# EAGLE design USB-BOARD (EAGLE 8.6.1)
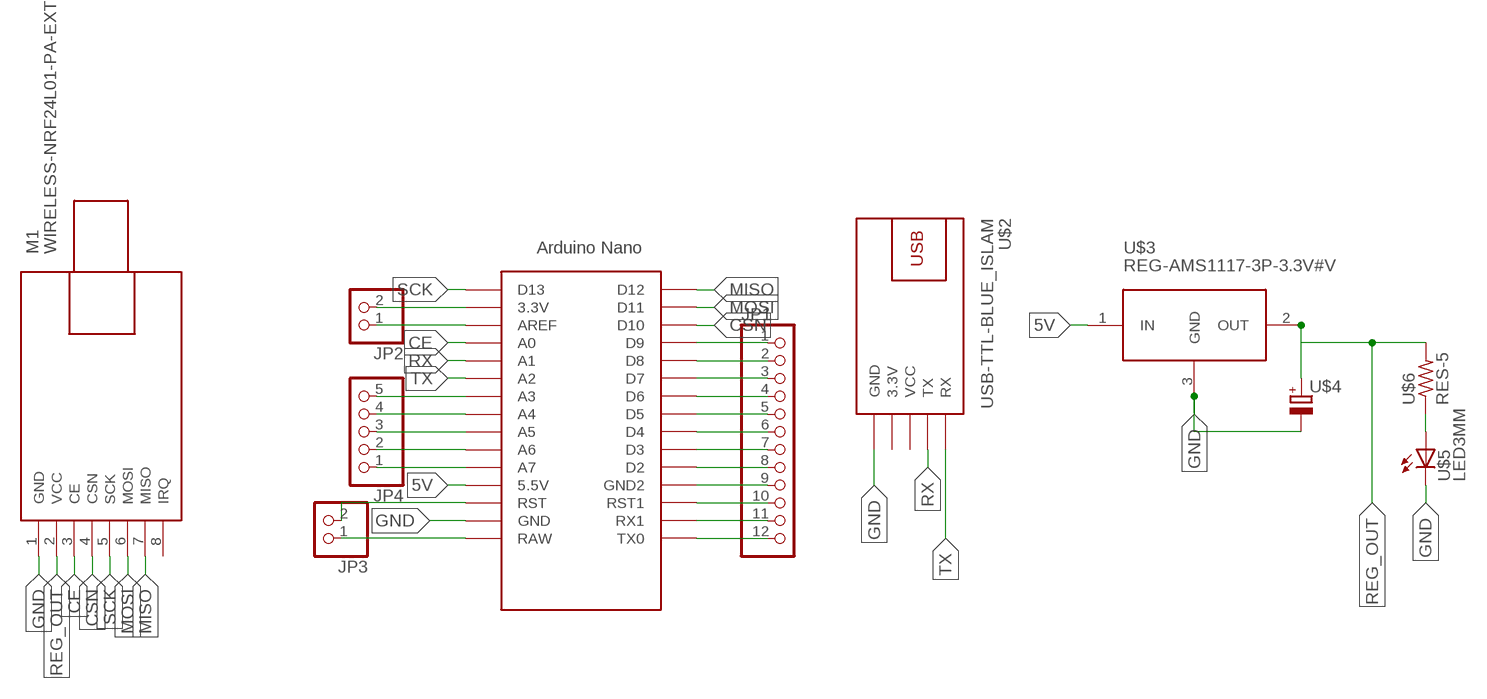
[diagram p0: schematic, sheet 1]

## Parts
JP1  PINHD-1X12  [1X12]
JP2  PINHD-1X2  [1X02]
JP3  PINHD-1X2  [1X02]
JP4  PINHD-1X5  [1X05]
M1  WIRELESS-NRF24L01-PA-EXT  [WIRELESS-NRF24L01-PA-EXT]
U$1  ARDUINO_NANO  [NANO]
U$2  USB-TTL-BLUE_ISLAM  [USB-TTL-BLUE]
U$3  REG-AMS1117-3P-3.3V#V  [REG-AMS1117-3P#V]
U$4  CAP_POL  [E3,5-8]
U$5  LED3MM  [LED3MM]
U$6  RES-5  [0204/5]

## Nets
5V: U$1.5V(5.5V) U$3.1(IN)
CE: M1.3(CE) U$1.A0
CSN: M1.4(CSN) U$1.D10
GND: M1.1(GND) U$1.GND U$2.GND U$3.3(GND) U$4.- U$5.K(C)
MISO: M1.7(MISO) U$1.D12
MOSI: M1.6(MOSI) U$1.D11
N$1: JP2.2 U$1.3.3V
N$2: JP2.1 U$1.AREF
N$3: JP4.5 U$1.A3
N$4: JP4.4 U$1.A4
N$5: JP4.3 U$1.A5
N$6: JP4.2 U$1.A6
N$7: JP4.1 U$1.A7
N$8: JP3.2 U$1.RST
N$9: JP3.1 U$1.RAW
N$10: JP1.12 U$1.TX0
N$11: JP1.11 U$1.RX1
N$12: JP1.10 U$1.RST1
N$13: JP1.9 U$1.GND1(GND2)
N$14: JP1.8 U$1.D2
N$15: JP1.7 U$1.D3
N$16: JP1.6 U$1.D4
N$17: JP1.5 U$1.D5
N$18: JP1.4 U$1.D6
N$19: JP1.3 U$1.D7
N$20: JP1.2 U$1.D8
N$21: JP1.1 U$1.D9
N$22: U$5.A U$6.1
REG_OUT: M1.2(VCC) U$3.2(OUT) U$4.+ U$6.2
RX: U$1.A1 U$2.TX
SCK: M1.5(SCK) U$1.D13
TX: U$1.A2 U$2.RX
Unconnected: M1.8(IRQ) U$2.3.3V

## Power pins joined to a net without a drawn wire
VCC: U$2.VCC

## Library data of the parts
JP1 = MIA_LIBRARY:PINHD-1X12: PIN HEADER
JP2 JP3 = MIA_LIBRARY:PINHD-1X2: PIN HEADER
JP4 = MIA_LIBRARY:PINHD-1X5: PIN HEADER
M1 = MIA_LIBRARY:WIRELESS-NRF24L01-PA-EXT: 2.4 GHz Wireless Module based on NRF24L01 chip with preamplifier and external antenna Click here to find device on ebay.com <http://www.ebay.com/sch/nrf24l01+pa+lna+sma>
U$1 = MIA_LIBRARY:ARDUINO_NANO: Arduino Nano
U$2 = MIA_LIBRARY:USB-TTL-BLUE_ISLAM: USB to Serial UART Converter based on FT232R chip More information about FT232R chip is available here: http://www.ftdichip.com/Products/ICs/FT232R.htm Click here to find device on ebay.com <http://www.ebay.com/sch/ft232rl+arduino+download+max232>
U$3 = MIA_LIBRARY:REG-AMS1117-3P-*: Linear Regulator based on AMS1117 chip 3-pin version AMS1117 datasheet is available here: http://www.advanced-monolithic.com/pdf/ds1117.pdf Click here to find device on ebay.com <http://www.ebay.com/sch/ams1117+module> Note: There are many variants. Search for the proper version.
U$4 = MIA_LIBRARY:CAP_POL
U$5 = MIA_LIBRARY:LED3MM
U$6 = MIA_LIBRARY:RES-5

## Board
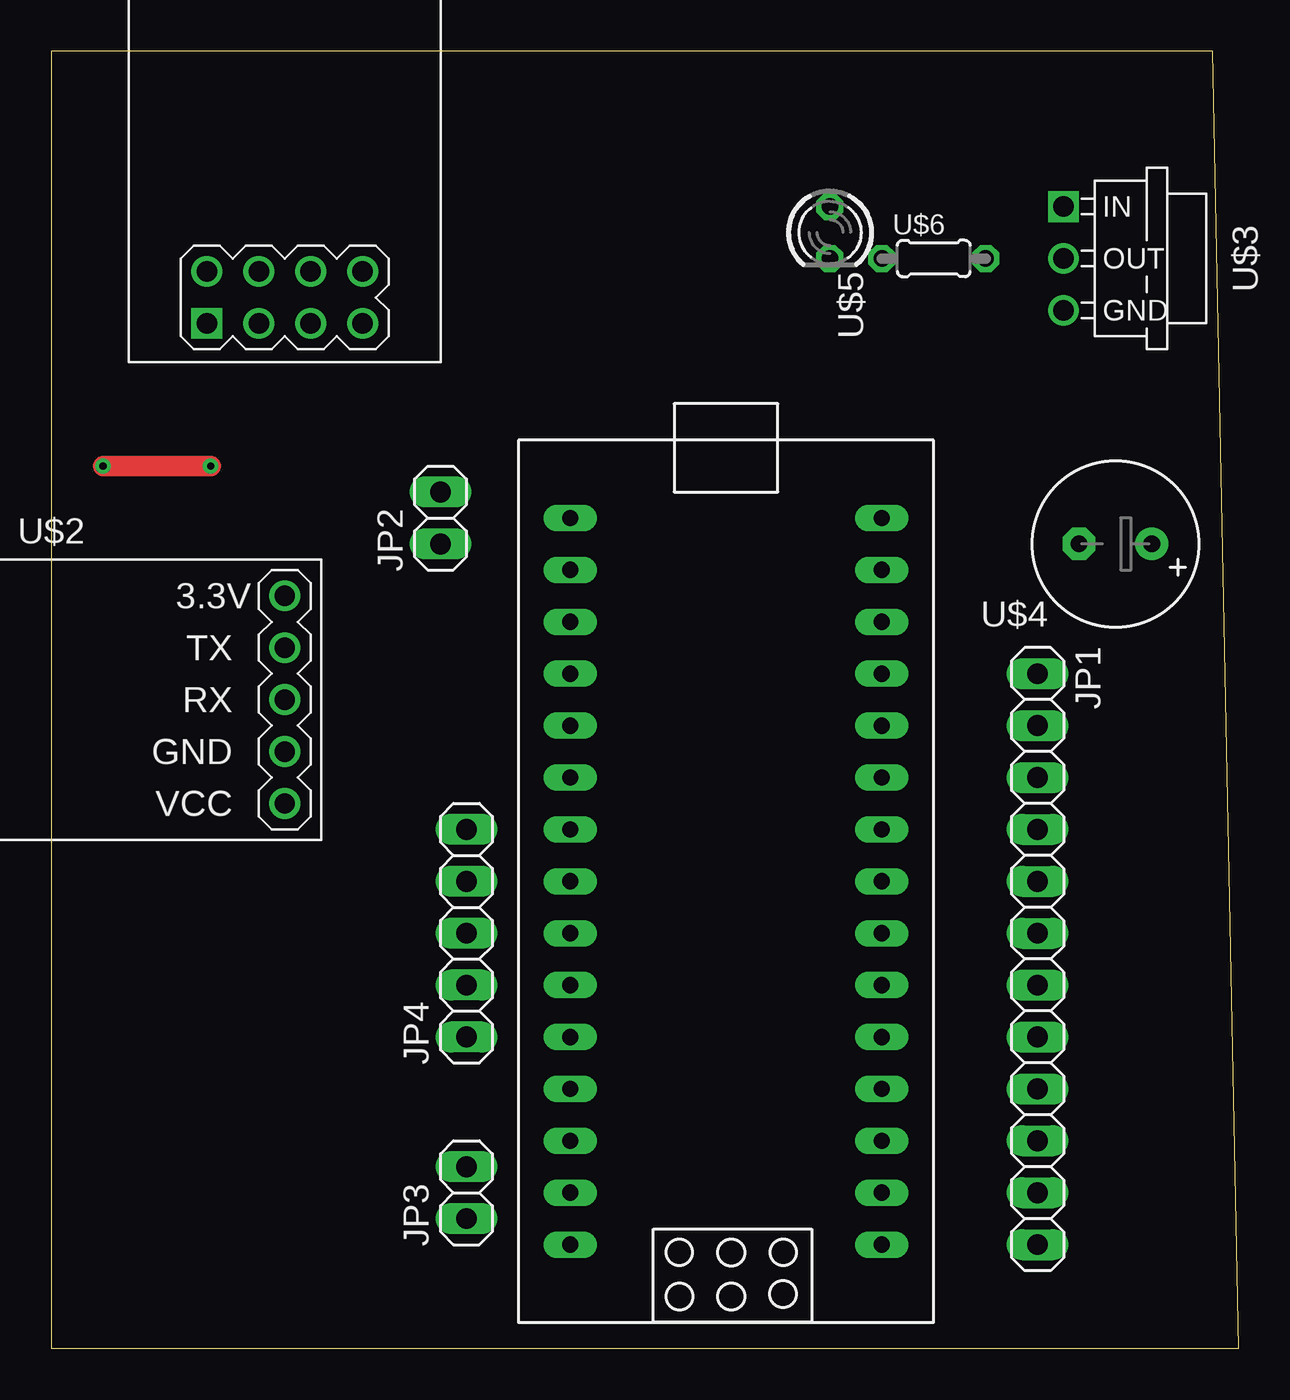
[diagram p1: board, top side]
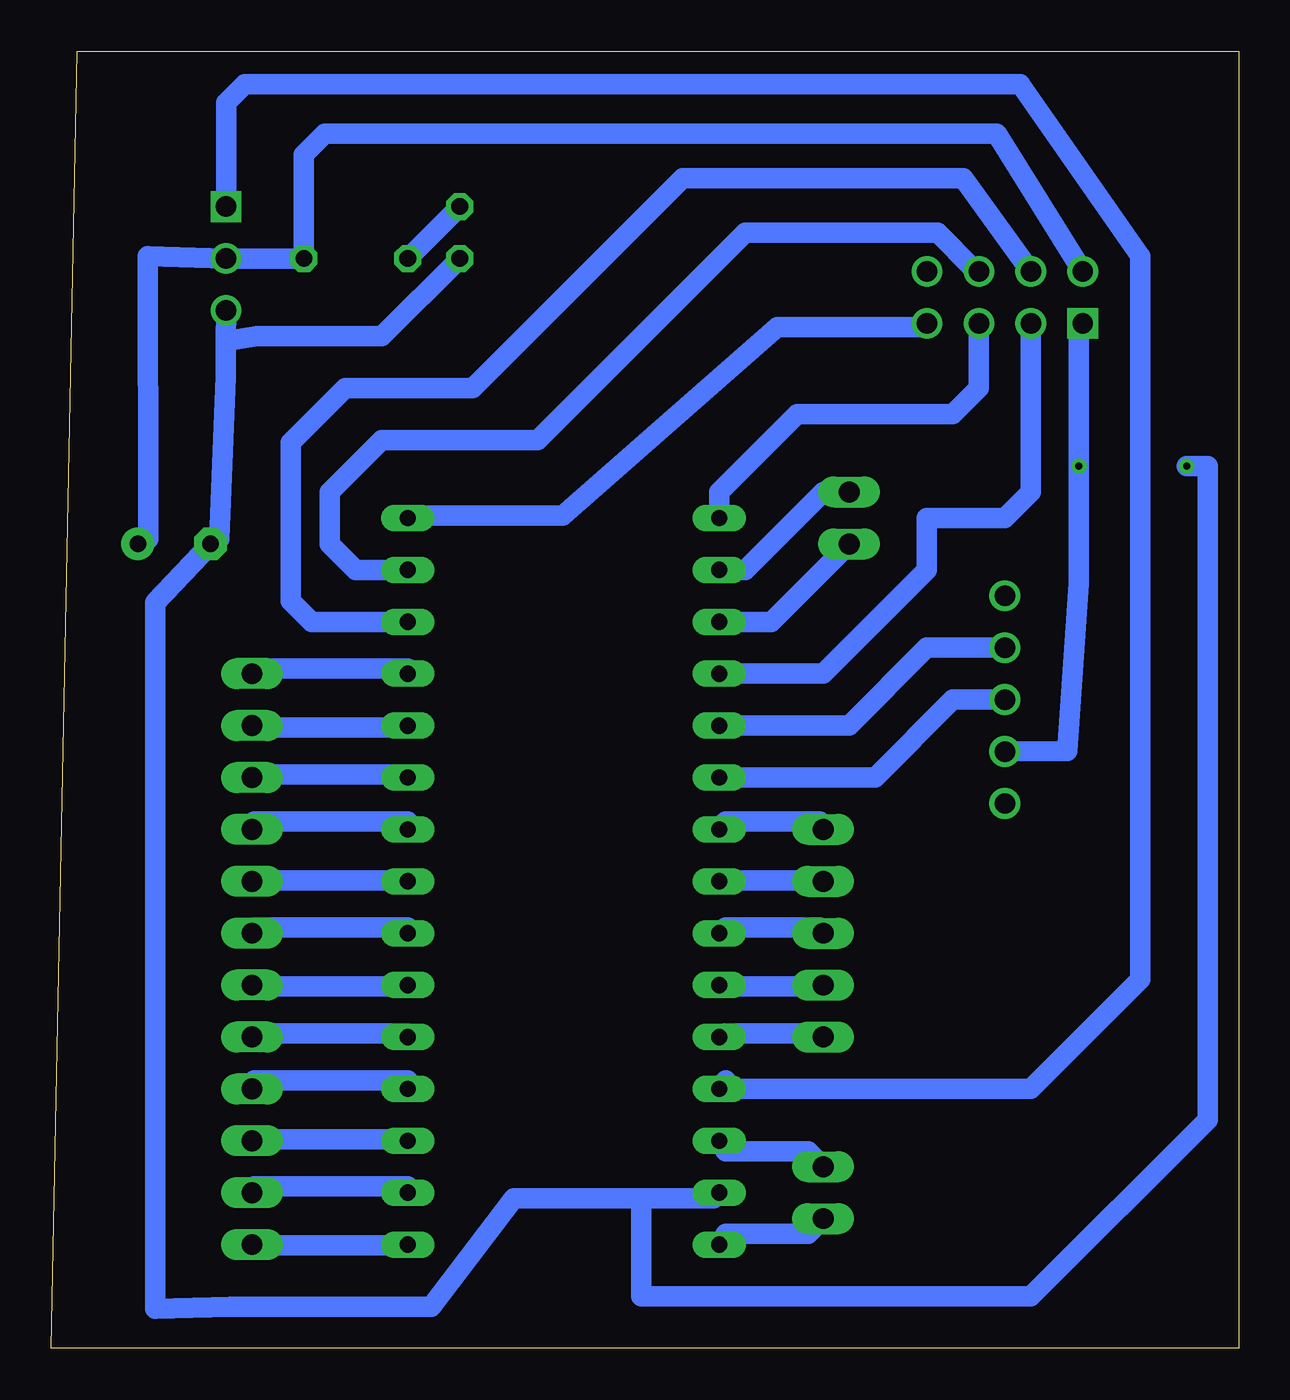
[diagram p2: board, bottom side, seen from below]

Size 58.09 x 63.49 mm. Coordinates in mm from the lower left corner, seen from the top.
Outline: 0,0 58.09,0 56.82,63.49 0,63.49 0,0
Copper layers (1*16): Top 0.035mm / dielectric 1.5mm / Bottom 0.035mm
Design rules "default *": minimum track width 1mm, minimum drill 0.35mm, track to track 6mil, track to pad 6mil, pad to pad 6mil, via to via 6mil, smd to smd 6mil, copper to edge 40mil, drill to drill 6mil, minimum pad ring 10mil, minimum via ring 8mil, stop-mask expansion 4mil, vias tented up to drill 0mil, thermal gap 10mil

### Footprints (pad centres in the part's own frame; a part is rotated, then mirrored left to right if it is on the bottom)
1X12 = drill 1.016 long: 1 -13.97,0; 2 -11.43,0; 3 -8.89,0; 4 -6.35,0; 5 -3.81,0; 6 -1.27,0; 7 1.27,0; 8 3.81,0; 9 6.35,0; 10 8.89,0; 11 11.43,0; 12 13.97,0
1X02 = drill 1.016 long: 1 -1.27,0; 2 1.27,0
1X05 = drill 1.016 long: 1 -5.08,0; 2 -2.54,0; 3 0,0; 4 2.54,0; 5 5.08,0
WIRELESS-NRF24L01-PA-EXT = drill 1 square: 1 -18.415,3.81 | drill 1: 2 -15.875,3.81; 3 -18.415,1.27; 4 -15.875,1.27; 5 -18.415,-1.27; 6 -15.875,-1.27; 7 -18.415,-3.81; 8 -15.875,-3.81
NANO = drill 0.8 long: 3.3V -10.16,24.13; 5V -10.16,-1.27; A0 -10.16,19.05; A1 -10.16,16.51; A2 -10.16,13.97; A3 -10.16,11.43; A4 -10.16,8.89; A5 -10.16,6.35; A6 -10.16,3.81; A7 -10.16,1.27; AREF -10.16,21.59; D2 5.08,1.27; D3 5.08,3.81; D4 5.08,6.35; D5 5.08,8.89; D6 5.08,11.43; D7 5.08,13.97; D8 5.08,16.51; D9 5.08,19.05; D10 5.08,21.59; D11 5.08,24.13; D12 5.08,26.67; D13 -10.16,26.67; GND -10.16,-6.35; GND1 5.08,-1.27; RAW -10.16,-8.89; RST -10.16,-3.81; RST1 5.08,-3.81; RX1 5.08,-6.35; TX0 5.08,-8.89
USB-TTL-BLUE = drill 1: 3.3V 11.43,3.81; GND 11.43,-3.81; RX 11.43,-1.27; TX 11.43,1.27; VCC 11.43,-6.35
REG-AMS1117-3P#V = drill 1 square: 1 -2.54,-5.08 | drill 1: 2 0,-5.08; 3 2.54,-5.08
E3,5-8 = drill 0.813 pad 1.6: + -1.778,0 | drill 0.813 pad 1.6 octagon: - 1.778,0
LED3MM = drill 0.813 octagon: A -1.27,0; K 1.27,0
0204/5 = drill 0.813 octagon: 1 -2.54,0; 2 2.54,0

### Placement (x,y rotation side)
JP1  48.26,19.05 270 top
JP2  19.05,40.64 90 top
JP3  20.32,7.62 90 top
JP4  20.32,20.32 90 top
M1  11.43,68.58 90 top
U$1  35.56,13.97 0 top
U$2  0,33.02 0 top
U$3  54.61,53.34 270 top
U$4  52.07,39.37 180 top
U$5  38.1,54.61 270 top
U$6  43.18,53.34 0 top

### Tracks (layer width: path | path; a pad name or v marks a point on that pad's centre or on a via)
5V
  Bottom 1: 25.09,13.11 U$1.5V 10.16,12.7 4.81,18.05 4.81,53.45 10.69,61.86 48.62,61.86 49.53,60.96 U$3.1
CE
  Bottom 1: M1.3 10.16,41.91 11.43,40.64 15.24,40.64 15.24,38.1 20.32,33.02 U$1.A0
CSN
  Bottom 1: M1.4 13.46,57.28 27.18,57.28 37.46,46.99 43.69,46.99 46.35,44.32 46.35,36.58 45.34,35.56 U$1.D10
GND  (via drill 0.35)
  Top 1: v2.54,43.18 v7.81,43.18
  Bottom 1: U$2.GND 8.37,29.25 7.81,37.43 v7.81,43.18 7.81,49.99 M1.1 | 29.21,7.35 35.47,7.35 39.5,2.05 49.29,2.05 52.99,1.93 52.99,36.5 U$4.- 49.87,39.62 49.54,47.57 49.54,49.29 | 29.21,7.35 25.67,7.35 U$1.GND | 49.54,49.29 U$3.3 | 29.21,7.35 29.21,2.54 10.16,2.54 1.52,11.18 1.52,43.18 v2.54,43.18 | U$5.K 41.91,49.53 48.04,49.53 49.54,49.29
MISO
  Bottom 1: U$1.D12 40.07,40.77 33.05,40.77 22.57,49.99 15.3,49.99 M1.7
MOSI
  Bottom 1: M1.6 12.99,52.87 14.72,54.6 24.14,54.6 34.29,44.45 41.91,44.45 44.45,41.91 44.45,39.37 43.18,38.1 U$1.D11
N$1
  Bottom 1: U$1.3.3V 24.13,38.1 20.32,41.91 JP2.2
N$2
  Bottom 1: JP2.1 22.86,35.56 U$1.AREF
N$3
  Bottom 1: U$1.A3 25.09,25.79 20.48,25.79 JP4.5
N$4
  Bottom 1: U$1.A4 25.09,22.91 20.48,22.91 JP4.4
N$5
  Bottom 1: U$1.A5 25.09,20.6 20.48,20.6 JP4.3
N$6
  Bottom 1: U$1.A6 25.09,17.72 20.48,17.72 JP4.2
N$7
  Bottom 1: U$1.A7 25.09,15.42 20.48,15.42 JP4.1
N$8
  Bottom 1: U$1.RST 25.09,9.65 21.06,9.65 20.48,9.08 JP3.2
N$9
  Bottom 1: U$1.RAW 25.09,5.62 21.06,5.62 20.48,6.2 JP3.1
N$10
  Bottom 1: U$1.TX0 40.65,5.04 48.14,5.04 JP1.12
N$11
  Bottom 1: U$1.RX1 40.65,7.93 48.14,7.93 JP1.11
N$12
  Bottom 1: U$1.RST1 40.65,10.23 48.14,10.23 JP1.10
N$13
  Bottom 1: U$1.GND1 40.65,13.11 48.14,13.11 JP1.9
N$14
  Bottom 1: U$1.D2 40.65,15.42 48.14,15.42 JP1.8
N$15
  Bottom 1: U$1.D3 40.65,17.72 48.14,17.72 JP1.7
N$16
  Bottom 1: U$1.D4 40.65,20.6 48.14,20.6 JP1.6
N$17
  Bottom 1: U$1.D5 40.65,22.91 48.14,22.91 JP1.5
N$18
  Bottom 1: U$1.D6 40.65,25.79 48.14,25.79 JP1.4
N$19
  Bottom 1: U$1.D7 40.65,28.09 48.14,28.09 JP1.3
N$20
  Bottom 1: U$1.D8 40.65,30.4 48.14,30.4 JP1.2
N$21
  Bottom 1: U$1.D9 40.65,33.28 48.14,33.28 JP1.1
N$22
  Bottom 1: U$5.A U$6.1
REG_OUT
  Bottom 1: M1.2 11.82,59.44 31.75,59.44 32,59.44 44.7,59.44 45.72,58.42 U$6.2 U$3.2 53.35,53.45 53.33,40.77 53.33,39.62 U$4.+
RX
  Bottom 1: U$1.A1 19.05,30.48 15.24,34.29 U$2.TX
SCK
  Bottom 1: M1.5 12.7,46.99 13.97,45.72 21.59,45.72 25.4,41.91 U$1.D13
TX
  Bottom 1: U$2.RX 13.97,31.75 17.78,27.94 U$1.A2